# EAGLE design Versie 3 (EAGLE 7.3.0)

## Sheet 1 of 2
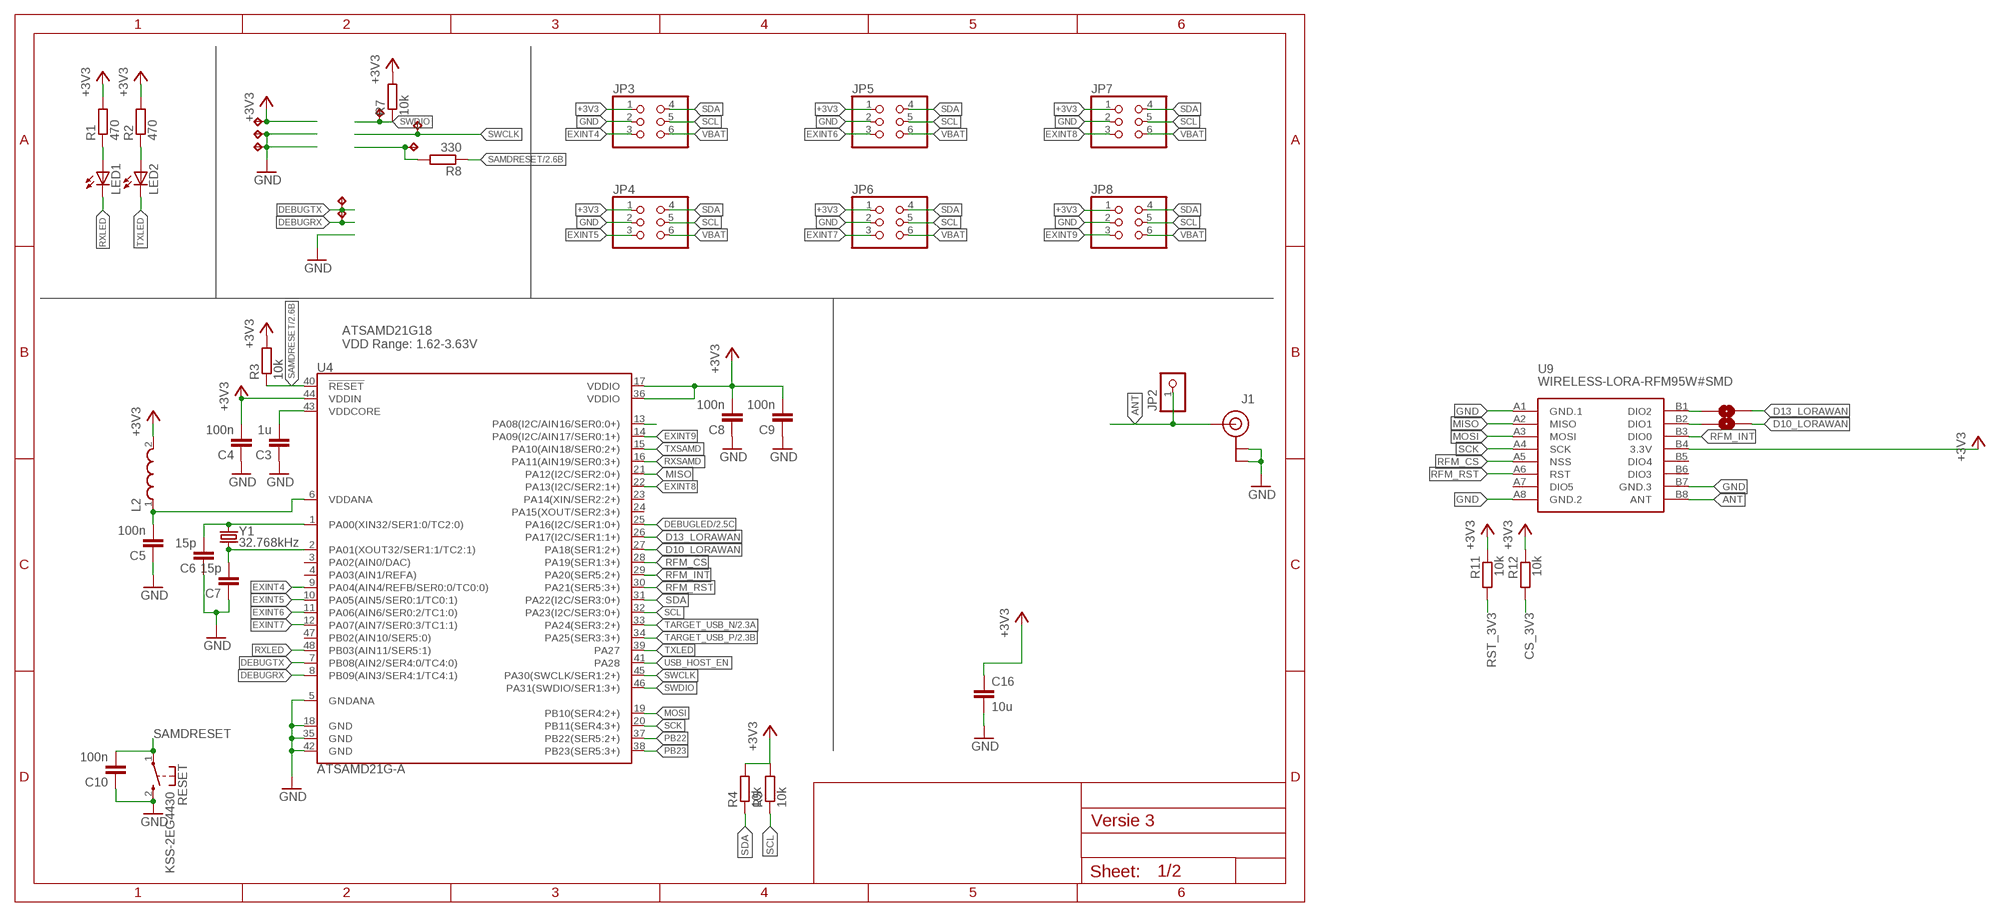
[diagram p0: schematic, sheet 1]

### Parts
C3  1u  C-EUC0603  [C0603]
C4  100n  C-EUC0603  [C0603]
C5  100n  C-EUC0603  [C0603]
C6  15p  C-EUC0603  [C0603]
C7  15p  C-EUC0603  [C0603]
C8  100n  C-EUC0603  [C0603]
C9  100n  C-EUC0603  [C0603]
C10  100n  C-EUC0603  [C0603]
C16  10u  C-EUC0603  [C0603]
J1  U.FL  [U.FL]
JP2  PINHD-1X1  [1X01]
JP3  PINHD-2X3  [2X03]
JP4  PINHD-2X3  [2X03]
JP5  PINHD-2X3  [2X03]
JP6  PINHD-2X3  [2X03]
JP7  PINHD-2X3  [2X03]
JP8  PINHD-2X3  [2X03]
JP9  JUMPER-SMT_2_NO_NO-SILK  [SMT-JUMPER_2_NO_NO-SILK]
JP10  JUMPER-SMT_2_NO_NO-SILK  [SMT-JUMPER_2_NO_NO-SILK]
L2  WE-CBA_0603(WB/HS)  [WE-CBA_0603(W=2.2)]
LED1  LEDCHIP-LED0603  [CHIP-LED0603]
LED2  LEDCHIP-LED0603  [CHIP-LED0603]
R1  470  R-EU_R0603  [R0603]
R2  470  R-EU_R0603  [R0603]
R3  10k  R-EU_R0603  [R0603]
R4  10k  R-EU_R0603  [R0603]
R5  10k  R-EU_R0603  [R0603]
R7  10k  R-EU_R0603  [R0603]
R8  330  R-EU_R0603  [R0603]
R11  10k  R-EU_0204/7  [0204/7]
R12  10k  R-EU_0204/7  [0204/7]
RESET  KSS-2EG4430  [KSS-2EG4430]
TP1  TPB1,27  [B1,27]
TP2  TPB1,27  [B1,27]
TP3  TPB1,27  [B1,27]
TP4  TPB1,27  [B1,27]
TP5  TPB1,27  [B1,27]
TP6  TPB1,27  [B1,27]
TP7  TPB1,27  [B1,27]
TP8  TPB1,27  [B1,27]
U4  ATSAMD21G-A  [TQFP-48]
U9  WIRELESS-LORA-RFM95W#SMD  [WIRELESS-LORA-RFM95W#SMD]
Y1  32.768kHz  CRYSTAL3.2X1.5MM  [CRYSTAL-SMD-3.2X1.5MM]

### Nets
+3V3: C4.2 C8.2 C9.2 C16.1 JP3.1 JP4.1 JP5.1 JP6.1 JP7.1 JP8.1 L2.2 R1.2 R2.2 R3.2 R4.2 R5.2 R7.2 R11.1 R12.1 TP1.TP U4.17(VDDIO) U4.36(VDDIO) U4.44(VDDIN) U9.B4(3.3V) ; also sheet 2
ANT: J1.P$3(SIGNAL) JP2.1 U9.B8(ANT)
BUTTON: U4.13(PA08(I2C/AIN16/SER0:0+)) ; also sheet 2
CS_3V3: R12.2
D10_LORAWAN: JP10.2 U4.27(PA18(SER1:2+))
D13_LORAWAN: JP9.2 U4.26(PA17(I2C/SER1:1+))
DEBUGLED: U4.25(PA16(I2C/SER1:0+)) ; also sheet 2
DEBUGRX: TP8.TP U4.8(PB09(AIN3/SER4:1/TC4:1))
DEBUGTX: TP7.TP U4.7(PB08(AIN2/SER4:0/TC4:0))
EXINT4: JP3.3 U4.9(PA04(AIN4/REFB/SER0:0/TC0:0))
EXINT5: JP4.3 U4.10(PA05(AIN5/SER0:1/TC0:1))
EXINT6: JP5.3 U4.11(PA06(AIN6/SER0:2/TC1:0))
EXINT7: JP6.3 U4.12(PA07(AIN7/SER0:3/TC1:1))
EXINT8: JP7.3 U4.22(PA13(I2C/SER2:1+))
EXINT9: JP8.3 U4.14(PA09(I2C/AIN17/SER0:1+))
GND: C3.1 C4.1 C5.1 C6.1 C7.1 C8.1 C9.1 C10.1 C16.2 J1.P$1(GND) J1.P$2(GND) JP3.2 JP4.2 JP5.2 JP6.2 JP7.2 JP8.2 RESET.2(S) TP2.TP TP3.TP U4.5(GNDANA) U4.18(GND) U4.35(GND) U4.42(GND) U9.A1(GND.1) U9.A8(GND.2) U9.B7(GND.3) ; also sheet 2
MISO: U4.21(PA12(I2C/SER2:0+)) U9.A2(MISO)
MOSI: U4.19(PB10(SER4:2+)) U9.A3(MOSI)
N$1: LED1.A R1.1
N$2: LED2.A R2.1
N$4: JP10.1 U9.B2(DIO1)
N$5: C6.2 U4.1(PA00(XIN32/SER1:0/TC2:0)) Y1.P$2
N$6: C7.2 U4.2(PA01(XOUT32/SER1:1/TC2:1)) Y1.P$1
N$7: C5.2 L2.1 U4.6(VDDANA)
N$13: JP9.1 U9.B1(DIO2)
N$15: R8.2 TP6.TP
PB22: U4.37(PB22(SER5:2+))
PB23: U4.38(PB23(SER5:3+))
RFM_CS: U4.28(PA19(SER1:3+)) U9.A5(NSS)
RFM_INT: U4.29(PA20(SER5:2+)) U9.B3(DIO0)
RFM_RST: U4.30(PA21(SER5:3+)) U9.A6(RST)
RST_3V3: R11.2
RXLED: LED1.C U4.48(PB03(AIN11/SER5:1))
RXSAMD: U4.16(PA11(AIN19/SER0:3+))
SAMDRESET: C10.2 R3.1 R8.1 RESET.1(P) U4.40(!RESET!) ; also sheet 2
SCK: U4.20(PB11(SER4:3+)) U9.A4(SCK)
SCL: JP3.5 JP4.5 JP5.5 JP6.5 JP7.5 JP8.5 R5.1 U4.32(PA23(I2C/SER3:0+))
SDA: JP3.4 JP4.4 JP5.4 JP6.4 JP7.4 JP8.4 R4.1 U4.31(PA22(I2C/SER3:0+))
SWCLK: TP5.TP U4.45(PA30(SWCLK/SER1:2+))
SWDIO: R7.1 TP4.TP U4.46(PA31(SWDIO/SER1:3+))
TARGET_USB_N: U4.33(PA24(SER3:2+)) ; also sheet 2
TARGET_USB_P: U4.34(PA25(SER3:3+)) ; also sheet 2
TXLED: LED2.C U4.39(PA27)
TXSAMD: U4.15(PA10(AIN18/SER0:2+))
USB_HOST_EN: U4.41(PA28)
VBAT: JP3.6 JP4.6 JP5.6 JP6.6 JP7.6 JP8.6 ; also sheet 2
VDDCORE: C3.2 U4.43(VDDCORE)
Unconnected: U4.3(PA02(AIN0/DAC)) U4.4(PA03(AIN1/REFA)) U4.23(PA14(XIN/SER2:2+)) U4.24(PA15(XOUT/SER2:3+)) U4.47(PB02(AIN10/SER5:0)) U9.A7(DIO5) U9.B5(DIO4) U9.B6(DIO3)

### Notes on the sheet
- ATSAMD21G18
  VDD Range: 1.62-3.63V

## Sheet 2 of 2
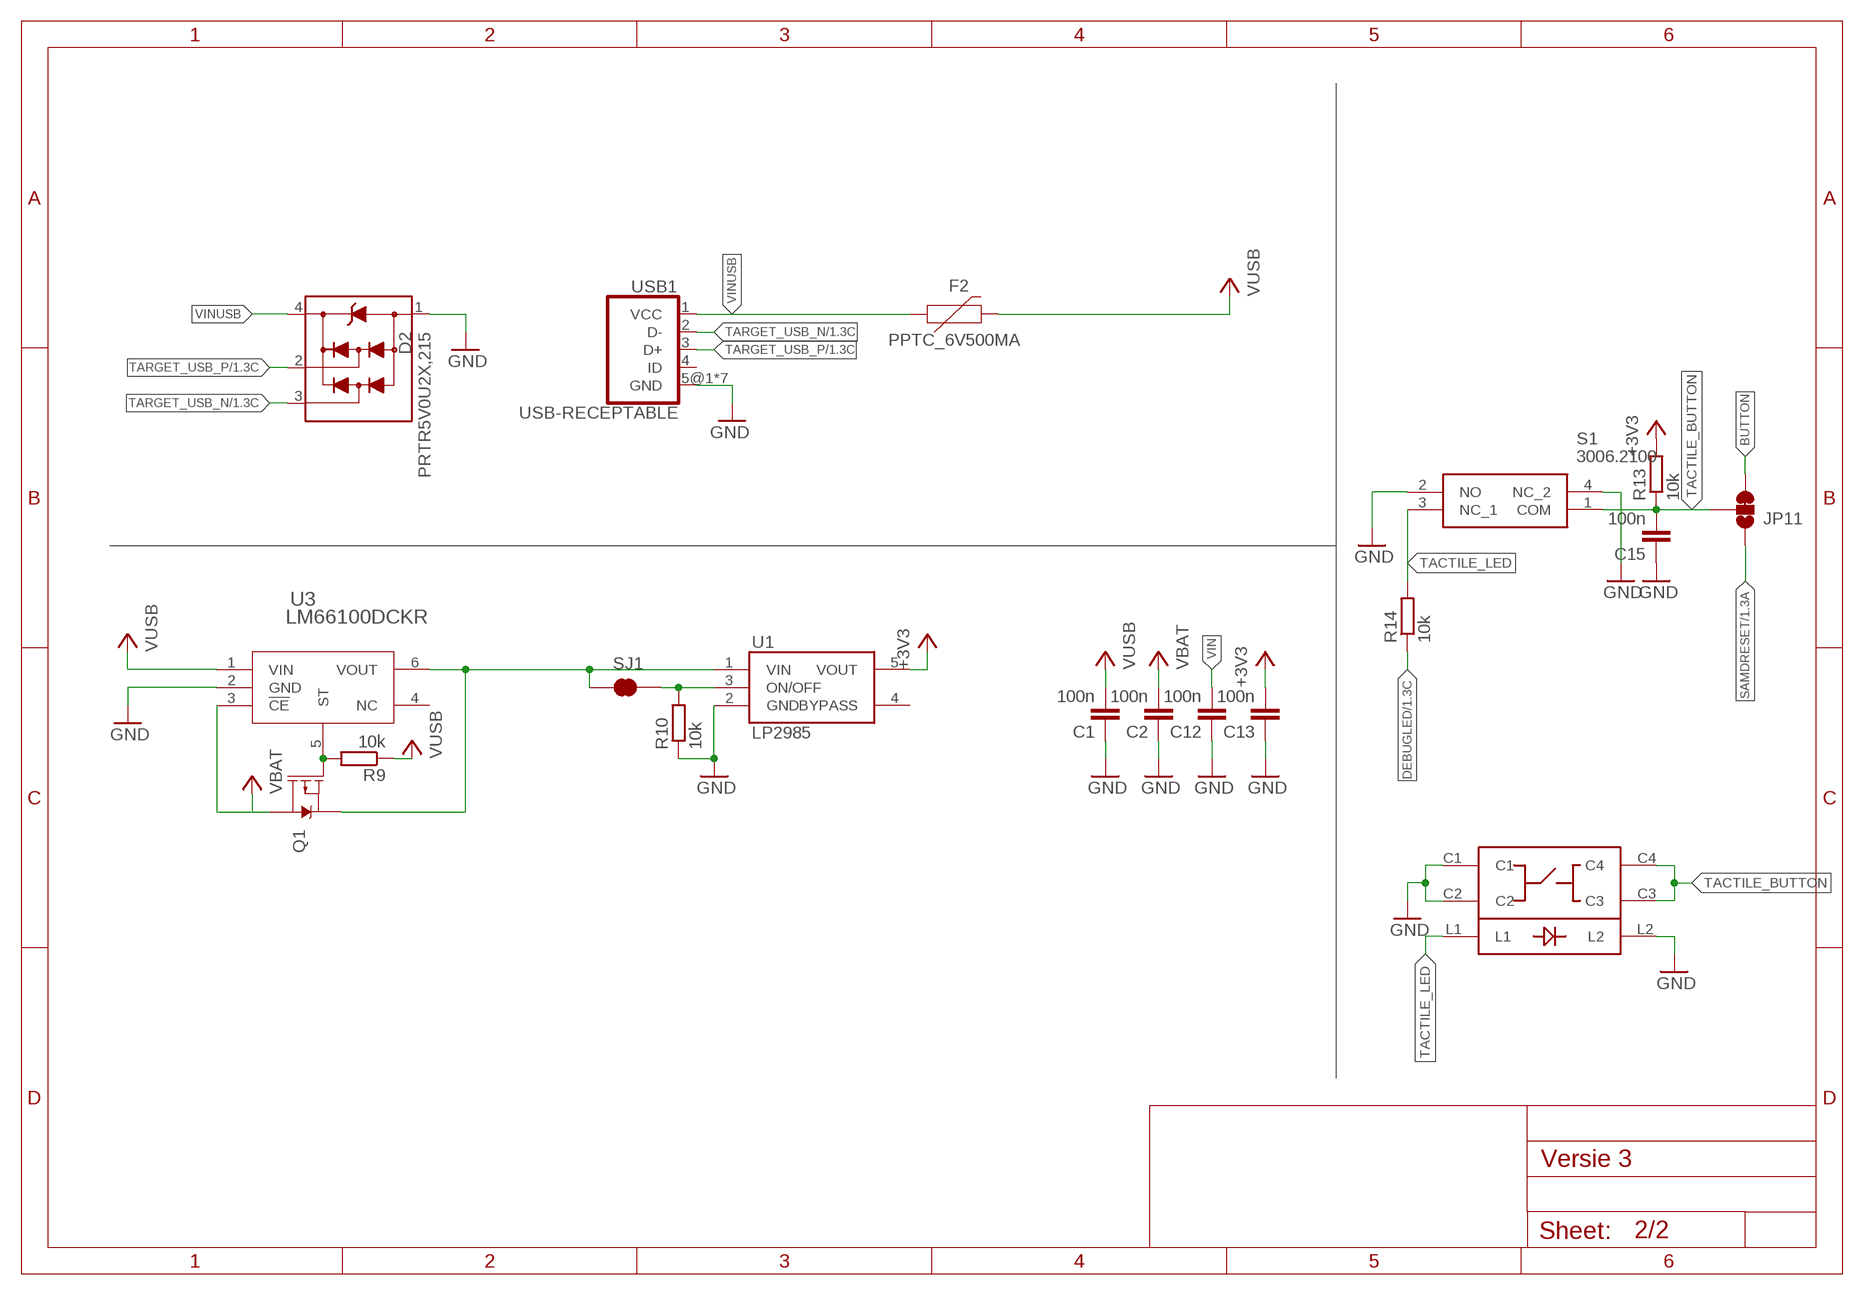
[diagram p1: schematic, sheet 2]

### Parts
C1  100n  C-EUC0603  [C0603]
C2  100n  C-EUC0603  [C0603]
C12  100n  C-EUC0603  [C0603]
C13  100n  C-EUC0603  [C0603]
C15  100n  C-EUC0603  [C0603]
D2  PRTR5V0U2X,215  [SOT143B]
F2  PPTC_6V500MA  [0805]
JP11  JUMPER-SMT_3_1-NC_TRACE_SILK  [SMT-JUMPER_3_1-NC_TRACE_SILK]
Q1  MOSFET_PCH-DMG2307L  [SOT23-3]
R9  10k  R-EU_R0603  [R0603]
R10  10k  R-EU_R0603  [R0603]
R13  10k  R-EU_R0603  [R0603]
R14  10k  R-EU_R0603  [R0603]
S1  3006.2100  [30062101]
SJ1  JUMPER-PAD-2-NC_BY_TRACENO_SILK  [PAD-JUMPER-2-NC_BY_TRACE_NO_SILK]
U1  LP2985AIM5-3.3  [SOT25]
U3  LM66100DCKR  [DCK6_TEX]
U$1  LS1201  [LS1201]
USB1  USB-RECEPTABLE  [FCI-10103594-0001LF]

### Nets
+3V3: C13.2 R13.2 U1.5(VOUT) ; also sheet 1
BUTTON: JP11.3 ; also sheet 1
DEBUGLED: R14.1 ; also sheet 1
GND: C1.1 C2.1 C12.1 C13.1 C15.1 D2.1 R10.1 S1.2(NO) S1.4(NC_2) U1.2(GND) U3.2(GND) U$1.C1 U$1.C2 U$1.L2 USB1.5@1(GND) USB1.5@2(GND) USB1.5@3(GND) USB1.5@4(GND) USB1.5@5(GND) USB1.5@6(GND) USB1.5@7(GND) ; also sheet 1
N$14: Q1.1(G) R9.2 U3.5(ST)
ONOFF: R10.2 SJ1.1 U1.3(ON/OFF)
SAMDRESET: JP11.1 ; also sheet 1
TACTILE_BUTTON: C15.2 JP11.2 R13.1 S1.1(COM) U$1.C3 U$1.C4
TACTILE_LED: R14.2 S1.3(NC_1) U$1.L1
TARGET_USB_N: D2.3 USB1.2(D-) ; also sheet 1
TARGET_USB_P: D2.2 USB1.3(D+) ; also sheet 1
VBAT: C2.2 Q1.3(D) U3.3(!CE) ; also sheet 1
VIN: C12.2 Q1.2(S) SJ1.2 U1.1(VIN) U3.6(VOUT)
VINUSB: D2.4 F2.1 USB1.1(VCC)
VUSB: C1.2 F2.2 R9.1 U3.1(VIN)
Unconnected: U1.4(BYPASS) U3.4(NC) USB1.4(ID)

## Library data of the parts
C1-C10 C12 C13 C15 C16 = rcl:C-EU: CAPACITOR, European symbol
D2 = PRTR5V0U2X_215:PRTR5V0U2X,215: Ultra low capacitance double rail-to-rail ESD protection diode Check prices <https://pricing.snapeda.com/parts/PRTR5V0U2X%2C215/Nexperia%20USA%20Inc./view-part?ref=eda>; AVAILABILITY: Good; DESCRIPTION: Clamp Ipp Tvs Diode Surface Mount SOT-143B; MF: Nexperia USA Inc.; MP: PRTR5V0U2X,215; PACKAGE: None; PRICE: None; PURCHASE-URL: https://pricing.snapeda.com/search/part/PRTR5V0U2X,215/?ref=eda
F2 = SparkFun-Fuses:PPTC: Resettable Fuse PPTC Resettable Fuse. Really a sort of resistor with a polymeric positive temperature coefficient whose resistance increases dramatically with an increase in temperature. When heated by the power passing through the resistance rises causing the current to be limited, protecting the circuit. This is achieved by the transition of the polymer from a crystalline to an amorphous state where the conductive carbon separates breaking the conductive pathways found in the cool crystalline structure. When a PPTC cools back down it resumes conducting letting the circuit turn back on. SparkFun Products: SparkFun RedBoard - Programmed with Arduino <https://www.sparkfun.com/products/12757> Pro Micro - 5V/16MHz <https://www.sparkfun.com/products/12640> Arduino Pro 328 - 5V/16MHz <https://www.sparkfun.com/products/10915> MP3 Trigger <https://www.sparkfun.com/products/13720>
J1 = SparkFun-Connectors:U.FL: SMD antenna connector- WRL-09144; PROD_ID: CONN-09193
JP2 = pinhead:PINHD-1X1: PIN HEADER
JP3-JP8 = pinhead_edge:PINHD-2X3: PIN HEADER
JP9 JP10 = SparkFun-Jumpers:JUMPER-SMT_2_NO: Normally open jumper This jumper has two pads in close proximity to each other. Apply solder to close the connection. Round pads are easier to solder for beginners, but are a lot larger. SparkFun Product that uses the round pads: SparkFun EL Sequencer <https://www.sparkfun.com/products/12781>
JP11 = SparkFun-Jumpers:JUMPER-SMT_3_1-NC_TRACE: Normally closed trace jumper (1 of 2 connections) This jumper has a trace between two pads so it's normally closed (NC). The other connection is normally open (NO). Use a razor knife to open the connection. For best results follow the IPC guidelines for cutting traces: Cutout at least 0.063 mm (0.005 in). Remove all loose material to clean up the cut area. Seal the cut with an approved epoxy. Reapply solder to reclose the connection, or to close the NO connection.
L2 = EagleLibrary_Wuerth_Elektronik_eiSos_rev16a:WE-CBA: WE-CBA SMD EMI Suppression Ferrite Bead Characteristics Reliable Ni-Sn electrodes High rated current up to 5A Recommended soldering: Reflow Operating temperature: -55°C to +125°C Applications * Perfect as data line filter and for uncoupling of distribution voltage *This special SMD chip bead ferrites can be put directly on the printed circuit board. They offer excellent anti-EMI properties and low DC-resistance. Placed very close next to the interference source even with smallest size 0402,maximal impedance at 1000 Ω can be reached. *High Speed: "High Speed " SMD ferrites WE-CBF have lower impedance in the lower frequency ranges thus they have only a low attenuation for fast signals. Application e.g. USB 2.0, IEEE 1394,LVDS *Wide Band: "Wide Band" SMD ferrites WE-CBF already show high impedance in low frequency range. Therefore they are wide band through the whole spectrum. Application e.g. control signats, RS232, RS422, DC/DC converter *High Current: "High Current " SMD ferrites WE-CBF are designed for high current (over 1 A). The rated current refers to 40K self-heating. High current SMD ferrites are available in all there types (High Speed, Wide Band and High Frequency). Application e.g. power supply, DC/DC converter *Advice: Pay attention for the use of SMD-Ferrites for high current>1A and ambient temperature over +85°C that the rated current has to be reduced when temperature is above +85°C (Derating). *At+100°C environment temperature the maximal rated current has to add up to only 60% of the data sheet value ,without an overload of the component. Variant abbreviation WB means WIDE BAND HS means HIGH SPEED HC means HIGH CURRENT <http://katalog.we-online.de/media/images/eisos/FeCBA_pf2.jpg> Details see: http://katalog.we-online.de/en/pbs/WE-CBA/ Created: 2015-02-02 2015 (C) Wurth Elektronik
LED1 LED2 = led:LED: LED OSRAM: - CHIPLED LG R971, LG N971, LY N971, LG Q971, LY Q971, LO R971, LY R971 LH N974, LH R974 LS Q976, LO Q976, LY Q976 LO Q996 - Hyper CHIPLED LW Q18S LB Q993, LB Q99A, LB R99A - SideLED LS A670, LO A670, LY A670, LG A670, LP A670 LB A673, LV A673, LT A673, LW A673 LH A674 LY A675 LS A676, LA A676, LO A676, LY A676, LW A676 LS A679, LY A679, LG A679 - Hyper Micro SIDELED® LS Y876, LA Y876, LO Y876, LY Y876 LT Y87S - SmartLED LW L88C, LW L88S LB L89C, LB L89S, LG L890 LS L89K, LO L89K, LY L89K LS L896, LA L896, LO L896, LY L896 - TOPLED LS T670, LO T670, LY T670, LG T670, LP T670 LSG T670, LSP T670, LSY T670, LOP T670, LYG T670 LG T671, LOG T671, LSG T671 LB T673, LV T673, LT T673, LW T673 LH T674 LS T676, LA T676, LO T676, LY T676, LB T676, LH T676, LSB T676, LW T676 LB T67C, LV T67C, LT T67C, LS T67K, LO T67K, LY T67K, LW E67C LS E67B, LA E67B, LO E67B, LY E67B, LB E67C, LV E67C, LT E67C LW T67C LS T679, LY T679, LG T679 LS T770, LO T770, LY T770, LG T770, LP T770 LB T773, LV T773, LT T773, LW T773 LH T774 LS E675, LA E675, LY E675, LS T675 LS T776, LA T776, LO T776, LY T776, LB T776 LHGB T686 LT T68C, LB T68C - Hyper Mini TOPLED® LB M676 - Mini TOPLED Santana® LG M470 LS M47K, LO M47K, LY M47K Source: http://www.osram.convergy.de LUXEON: - LUMILED® LXK2-PW12-R00, LXK2-PW12-S00, LXK2-PW14-U00, LXK2-PW14-V00 LXK2-PM12-R00, LXK2-PM12-S00, LXK2-PM14-U00 LXK2-PE12-Q00, LXK2-PE12-R00, LXK2-PE12-S00, LXK2-PE14-T00, LXK2-PE14-U00 LXK2-PB12-K00, LXK2-PB12-L00, LXK2-PB12-M00, LXK2-PB14-N00, LXK2-PB14-P00, LXK2-PB14-Q00 LXK2-PR12-L00, LXK2-PR12-M00, LXK2-PR14-Q00, LXK2-PR14-R00 LXK2-PD12-Q00, LXK2-PD12-R00, LXK2-PD12-S00 LXK2-PH12-R00, LXK2-PH12-S00 LXK2-PL12-P00, LXK2-PL12-Q00, LXK2-PL12-R00 Source: www.luxeon.com KINGBRIGHT: KA-3528ASYC Source: www.kingbright.com
Q1 = SparkFun-DiscreteSemi:MOSFET_PCH: P-channel MOSFETs Voltage controlled devices that allow control of high current outputs. SparkFun Products: SparkFun ESP32 Thing <https://www.sparkfun.com/products/13907> SparkFun ESP8266 Thing <https://www.sparkfun.com/products/13231>; PROD_ID: TRANS-11308; VALUE: 2.5A/30V/105mΩ
R1-R5 R7-R10 R13 R14 = rcl:R-EU_: RESISTOR, European symbol
R11 R12 = resistor:R-EU_: RESISTOR, European symbol
RESET = buttons:KSS-2EG4430: Size: 3x6mm Height: 5mm from PCB Rating: DC12v 50mA Travel: 0.25±0.10mm Operating Force: 180±50gf Return Force: 60gf min Contact resistance: 100m? max Insulation resistance: 100M? min Operating life?50,000 cycles
S1 = SamacSys_Parts:3006.2100: Tactile Switches TACTILE Source: Datasheet <http://www.mouser.cn/datasheet/2/467/Marquardt_007102018_Specifcation3006_Series-1379934.pdf>; DESCRIPTION: Tactile Switches TACTILE; HEIGHT: 4.15mm; MANUFACTURER_NAME: MARQUARDT; MANUFACTURER_PART_NUMBER: 3006.2100; MOUSER_PART_NUMBER: 979-3006.2100
SJ1 = SparkFun-Passives:JUMPER-PAD-2-NC_BY_TRACE
TP1-TP8 = testpad:TP: Test pad
U1 = LP2985:LP2985: LP2985-N Micropower 150 mA Low-Noise Ultra Low-Dropout Regulator
U3 = LM66100:LM66100DCKR; BUILT_BY: EMA_Jessica; COPYRIGHT: Copyright (C) 2018 Accelerated Designs. All rights reserved; MANUFACTURER_PART_NUMBER: LM66100DCKR; SOURCELIBRARY: TI_2019-12-20; VENDOR: Texas Instruments
U4 = samd21-temp:ATSAMD21G: Atmel SAMD21G SMART ARM-Based Microcontroller The Atmel ® | SMART ™ SAM D21 is a series of low-power microcontrollers using the 32-bit ARM ® Cortex ® -M0+ processor, and ranging from 32- to 64-pins with up to 256KB Flash and 32KB of SRAM. The SAM D21 devices operate at a maximum frequency of 48MHz and reach 2.46 CoreMark/MHz. They are designed for simple and intuitive migration with identical peripheral modules, hex compatible code, identical linear address map and pin compatible migration paths between all devices in the product series. All devices include intelligent and flexible peripherals, Atmel Event System for inter-peripheral signaling, and support for capacitive touch button, slider and wheel user interfaces.; PROD_ID: IC-13064
U9 = diy-modules:WIRELESS-LORA-RFM95W: 868/915 MHz LoRa Radio Transceiver Module based on SX1276 chip Click here to find device on ebay.com <http://www.ebay.com/sch/RFM95W+transceiver>
U$1 = button:LS1201
USB1 = daspilker:USB-RECEPTABLE: USB Receptable
Y1 = samd21-temp:CRYSTAL: Various standard crystals. Proven footprints.; PROD_ID: XTAL-13062

## Net classes
0 default: clearance 0.205 mm

## Board
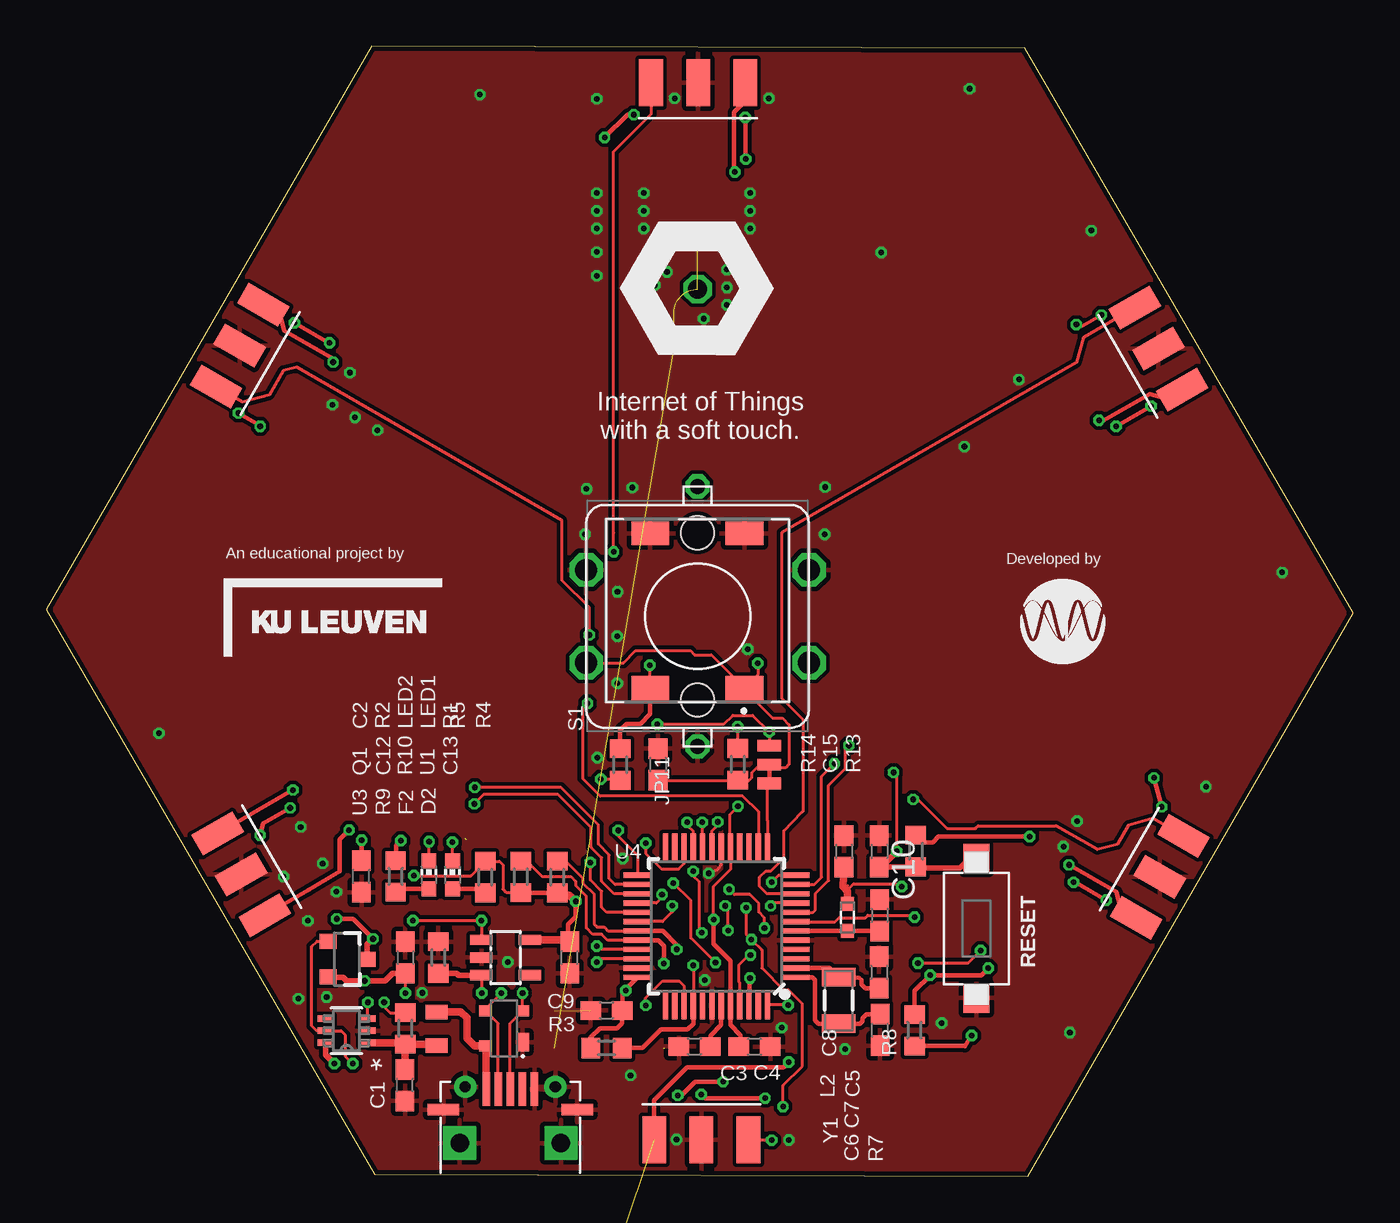
[diagram p2: board, top side]
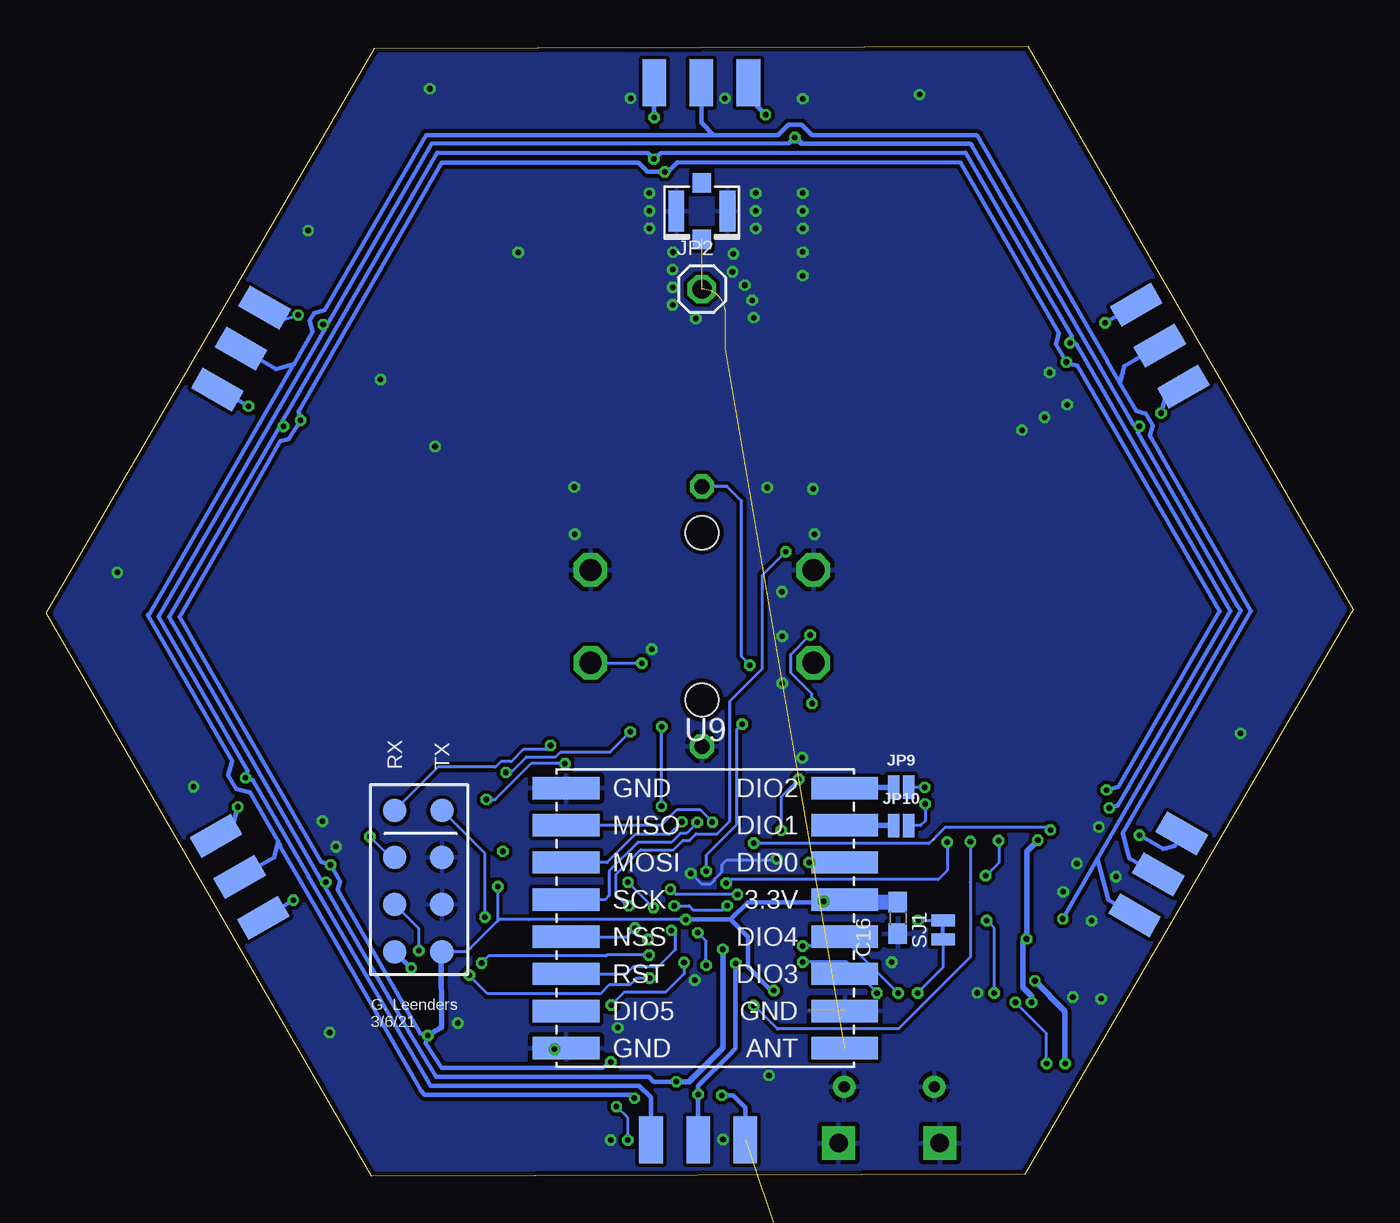
[diagram p3: board, bottom side, seen from below]

Size 70.33 x 60.81 mm. Coordinates in mm from the lower left corner, seen from the top.
Outline: 0,30.5 17.66,0.09 52.83,0 70.33,30.31 52.66,60.72 17.5,60.81 0,30.5
Copper layers (1*16): Top 0.035mm / dielectric 1.5mm / Bottom 0.035mm
Design rules "SeeedStudio_2layer_DRU_no_angle_20140221 *": minimum track width 6mil, minimum drill 0.3mm, track to track 6mil, track to pad 6mil, pad to pad 6mil, via to via 6mil, smd to smd 0mil, copper to edge 10mil, drill to drill 10mil, minimum pad ring 10mil, minimum via ring 6mil, stop-mask expansion 2mil, vias tented up to drill 100mil, thermal gap 10mil

### Footprints (pad centres in the part's own frame; a part is rotated, then mirrored left to right if it is on the bottom)
C0603 = smd 1.1 x 1: 1 -0.85,0; 2 0.85,0
SOT143B = smd 1 x 0.7: 1 -0.75,-1 | smd 0.6 x 0.7: 2 0.95,-1; 3 0.95,1; 4 -0.95,1
0805 = smd 0.8 x 1.2: 1 -0.9,0; 2 0.9,0
U.FL = smd 2.2 x 0.85: P$1 0,1.375; P$2 0,-1.375 | smd 1.05 x 1: P$3 1.525,0; P$4 -1.525,0
1X01 = drill 1.016 octagon: 1 0,0
2X03 = smd 1.27 x 2.54: 1 -2.54,1.905; 2 0,1.905; 3 2.54,1.905 | smd 1.27 x 2.54 bottom: 4 -2.54,1.905; 5 0,1.905; 6 2.54,1.905
SMT-JUMPER_2_NO_NO-SILK = smd 0.635 x 1.27: 1 -0.406,0; 2 0.406,0
SMT-JUMPER_3_1-NC_TRACE_SILK = smd 0.635 x 1.27: 1 -1.016,0; 2 0,0; 3 1.016,0
WE-CBA_0603(W=2.2) = smd 0.75 x 0.7: 1 -0.725,0; 2 0.725,0
CHIP-LED0603 = smd 0.8 x 0.8: A 0,-0.75; C 0,0.75
SOT23-3 = smd 0.8 x 0.9: 1 -0.95,-1; 2 0.95,-1; 3 0,1.1
R0603 = smd 1 x 1.1: 1 -0.85,0; 2 0.85,0
0204/7 = drill 0.813 octagon: 1 -3.81,0; 2 3.81,0
KSS-2EG4430 = smd 1.6 x 1.4: 1 -3.75,0; 2 3.75,0
30062101 = smd 2.025 x 1.275: 1 2.537,-4.162; 2 -2.538,4.162; 3 -2.538,-4.162; 4 2.537,4.162
PAD-JUMPER-2-NC_BY_TRACE_NO_SILK = smd 0.635 x 1.27: 1 -0.508,0; 2 0.508,0
B1,27 = smd 1.27 x 1.27: TP 0,0
SOT25 = smd 0.55 x 1.2: 1 -0.95,-1.3; 2 0,-1.3; 3 0.95,-1.3; 4 0.95,1.3; 5 -0.95,1.3
DCK6_TEX = smd 0.851 x 0.356: 1 -1.137,0.65; 2 -1.137,0; 3 -1.137,-0.65; 4 1.137,-0.65; 5 1.137,0; 6 1.137,0.65
TQFP-48 = smd 1.5 x 0.28: 1 -4.25,2.75; 2 -4.25,2.25; 3 -4.25,1.75; 4 -4.25,1.25; 5 -4.25,0.75; 6 -4.25,0.25; 7 -4.25,-0.25; 8 -4.25,-0.75; 9 -4.25,-1.25; 10 -4.25,-1.75; 11 -4.25,-2.25; 12 -4.25,-2.75; 25 4.25,-2.75; 26 4.25,-2.25; 27 4.25,-1.75; 28 4.25,-1.25; 29 4.25,-0.75; 30 4.25,-0.25; 31 4.25,0.25; 32 4.25,0.75; 33 4.25,1.25; 34 4.25,1.75; 35 4.25,2.25; 36 4.25,2.75 | smd 0.28 x 1.5: 13 -2.75,-4.25; 14 -2.25,-4.25; 15 -1.75,-4.25; 16 -1.25,-4.25; 17 -0.75,-4.25; 18 -0.25,-4.25; 19 0.25,-4.25; 20 0.75,-4.25; 21 1.25,-4.25; 22 1.75,-4.25; 23 2.25,-4.25; 24 2.75,-4.25; 37 2.75,4.25; 38 2.25,4.25; 39 1.75,4.25; 40 1.25,4.25; 41 0.75,4.25; 42 0.25,4.25; 43 -0.25,4.25; 44 -0.75,4.25; 45 -1.25,4.25; 46 -1.75,4.25; 47 -2.25,4.25; 48 -2.75,4.25
WIRELESS-LORA-RFM95W#SMD = smd 3.6 x 1.2: A1 -7.5,7; A2 -7.5,5; A3 -7.5,3; A4 -7.5,1; A5 -7.5,-1; A6 -7.5,-3; A7 -7.5,-5; A8 -7.5,-7; B1 7.5,7; B2 7.5,5; B3 7.5,3; B4 7.5,1; B5 7.5,-1; B6 7.5,-3; B7 7.5,-5; B8 7.5,-7
LS1201 = drill 1.2 octagon: C1 0,5; C2 12,5; C3 0,0; C4 12,0 | drill 0.8 octagon: L1 6,9.5; L2 6,-4.5 | hole 1.8: 6,-2; 6,7
FCI-10103594-0001LF = smd 0.4 x 1.8: 1 -1.3,4.6; 2 -0.65,4.6; 3 0,4.6; 4 0.65,4.6; 5@1 1.3,4.6 | drill 0.6 pad 1.2: 5@2 -2.425,4.73; 5@3 2.425,4.73 | drill 1 pad 1.778 square: 5@4 -2.725,1.7; 5@5 2.725,1.7 | smd 1.7 x 0.635: 5@6 -3.6,3.5; 5@7 3.6,3.5
CRYSTAL-SMD-3.2X1.5MM = smd 1 x 1.8: P$1 -1.25,0; P$2 1.25,0

### Placement (x,y rotation side)
C1  19.3,4.9 90 top
C2  16.95,16.14 90 top
C3  34.88,6.99 0 top
C4  38.11,6.97 180 top
C5  44.84,14.04 270 top
C6  44.87,7.87 90 top
C7  44.82,10.97 270 top
C8  42.92,17.48 270 top
C9  30.15,8.92 0 top
C10  44.83,17.49 270 top
C12  19.31,11.77 270 top
C13  28.17,11.77 90 top
C15  32.92,22.16 270 top
C16  24.5,13.9 270 bottom
D2  24.64,7.96 90 top
F2  21,7.93 270 top
J1  35.05,51.95 270 bottom
JP2  35.05,47.75 0 bottom
JP3  35.08,60.76 180 top
JP4  61.51,45.5 120 top
JP5  61.58,15.16 60 top
JP6  35.25,0.05 0 top
JP7  8.83,15.3 300 top
JP8  8.75,45.66 240 top
JP9  24.32,20.94 0 bottom
JP10  24.32,18.87 0 bottom
JP11  38.91,22.15 270 top
L2  43.13,13.93 90 top
LED1  21.85,16.21 0 top
LED2  20.58,16.21 0 top
Q1  16.16,11.68 270 top
R1  23.62,16.1 90 top
R2  18.79,16.14 90 top
R3  30.15,6.9 180 top
R4  27.49,16.1 270 top
R5  25.53,16.11 270 top
R7  46.72,7.86 270 top
R8  46.8,17.5 90 top
R9  19.31,7.96 90 top
R10  21.09,11.77 270 top
R11  16.07,-59.07 0 top  (outside the outline)
R12  6.54,-72.72 0 top  (outside the outline)
R13  37.21,22.18 90 top
R14  30.88,22.15 90 top
RESET  50.05,13.34 270 top
S1  35.04,30.44 0 top
SJ1  22.06,13.25 90 bottom
TP1  49.05,12.09 0 bottom
TP2  49.05,14.63 0 bottom
TP3  49.05,17.17 0 bottom
TP4  51.59,12.09 0 bottom
TP5  51.59,14.63 0 bottom
TP6  51.59,17.17 0 bottom
TP7  49.04,19.69 0 bottom
TP8  51.58,19.69 0 bottom
U1  24.71,11.77 270 top
U3  16.15,7.83 180 top
U4  36.07,13.45 180 top
U9  34.86,13.89 0 bottom
U$1  29.04,27.63 0 top
USB1  24.97,0.08 0 top
Y1  42.64,9.46 270 top

### Tracks (layer width: path | path; a pad name or v marks a point on that pad's centre or on a via)
+3V3  (via drill 0.3)  (2 unrouted)
  Top 0.152: 36.83,17.69 36.83,16.52 35.91,15.6 v35.91,13.81 | R13.2 v37.21,24.19 v37.2,24.2 | U4.17 36.8,17.72 36.8,19.48 v37.22,19.91 | 43.13,15.65 L2.2 43.12,14.64 43.12,15.41 43.45,15.74 45.89,15.74 v46.04,15.59 | 23.98,16.95 24.38,16.95 24.57,16.76 24.57,15.46 24.75,15.29 25.51,15.29 R5.2 | v19.77,16.18 22.85,16.18 R1.2
  Top 0.254: 37.28,6.84 C4.2 37.36,6.92 37.36,7.59 36.82,8.14 U4.44 36.83,9.21 36.83,11.59 35.91,12.51 v35.91,13.81 | 31,9.88 C9.2 30.99,8.91 30.99,8.23 30.72,7.96 29.79,7.96 29.3,7.46 R3.2 | 31,9.88 U4.36 | 31,9.88 31.08,9.88 v31.19,9.99 | 36.83,17.69 U4.17 | R1.2 23.98,16.95 | R5.2 26.32,15.26 26.34,15.25 R4.2 28.03,15.25 v28.48,14.79 v28.49,14.79 28.49,13.97 28.07,13.55 28.07,12.72 | R2.2 18.82,17.8 v19.07,18.06 | R7.2 49.41,7.01 49.45,7 v49.79,7.57 49.79,7.58 | JP6.1 32.71,4.1 34.47,5.85 39.66,5.85 v39.95,6.14 | v13.26,20.79 JP7.1 | JP8.1 12.57,46.38 12.8,45.51 15.37,44.03 v15.43,43.82 | JP3.1 37.62,57.88 37,57.26 37,54.11 v37.06,54.06 | JP4.1 60.29,41.86 59.38,42.11 56.83,40.63 v56.65,40.68 | JP5.1 57.84,14.38 57.59,15.3 55.06,16.76 v55.03,16.76
  Top 0.406: U1.5 28.07,12.72 C13.2 | 28.15,15.12 v28.48,14.79 | L2.2 43.13,15.34 42.87,15.59 C8.2
  Bottom 0.152: TP1.TP 47.69,12.08 47.49,12.28 46.04,13.74 | v35.91,13.81 44.36,13.81 45.99,13.81 | 45.99,13.81 | 45.99,13.81 45.99,13.79 46.04,13.74 | v46.04,15.59 46.04,13.74 | v19.07,18.06 19.07,16.85 v19.77,16.18 | v37.22,19.91 37.22,24.17 v37.21,24.19
  Bottom 0.254: v15.43,43.82 15.43,43.78 14.84,43.62 7.18,30.4 7.19,30.4 12.31,21.53 12.64,20.96 v13.26,20.79 | v39.95,6.14 40.4,5.85 49.07,5.82 49.91,7.15 v49.79,7.57 50.21,7.68 50.36,7.94 54.66,15.42 54.53,15.88 v55.03,16.76 55.08,16.79 55.55,16.91 62.15,28.35 63.16,30.1 63.16,30.11 60.43,34.83 57.76,39.57 57.29,39.69 v56.65,40.68 56.64,40.7 56.76,41.16 49.17,54.37 49.05,54.56 38.47,54.56 37.97,54.06 v37.06,54.06 36.88,54.06 36.37,54.57 21.13,54.56 21.11,54.53 15.82,45.38 15.98,44.78 v15.43,43.82 | 49.08,12.08 TP1.TP 49.06,12.07 | v15.43,43.82 | v35.91,13.81 33.51,13.81 | 33.51,13.81 32.58,14.75 28.53,14.75 v28.48,14.79 28.39,14.89 U9.B4 | v31.19,9.99 31.31,9.99 32.58,11.25 32.58,12.88 33.51,13.81
  Bottom 0.305: 49.08,12.08 49.07,8 v49.79,7.57
  Bottom 0.406: 49.05,12.11 TP1.TP
  Bottom 0.813: C16.1 28.44,14.75 v28.48,14.79
ANT  (7 unrouted)
BUTTON
  Top 0.152: U4.13 38.8,19.14 38.8,20.87 JP11.3
D10_LORAWAN  (via drill 0.3)
  Top 0.152: U4.27 30.55,15.2 29.88,15.87 29.88,17.14 29.32,17.7 29.32,18.77 27.55,20.54 23.53,20.54 v23.03,20.04
  Bottom 0.152: v23.03,20.04 23.03,19.12 23.28,18.87 JP10.2
D13_LORAWAN  (via drill 0.3)
  Top 0.152: U4.26 30.61,15.7 30.29,16.02 30.29,17.29 29.71,17.88 29.71,18.92 27.7,20.93 v23.05,20.93
  Bottom 0.152: v23.05,20.93 JP9.2
DEBUGLED  (via drill 0.3)
  Top 0.152: 30.78,21.17 R14.1 30.81,21.38 v29.84,21.38 | v30.78,18.61 30.78,18.3 31.82,17.26 U4.25
  Bottom 0.152: v30.78,18.61 30.78,20.44 v29.84,21.38
DEBUGRX  (via drill 0.3)
  Top 0.152: U4.8 41.27,14.2 41.39,14.32 41.39,15.21 42.1,15.92 42.1,21.03 43.01,21.94 43.01,23.01 v43.19,23.19
  Bottom 0.152: v43.19,23.19 43.42,22.96 44.67,22.96 45.3,22.32 45.86,22.32 46.16,22.02 49.25,22.02 TP8.TP
DEBUGTX  (via drill 0.3)
  Top 0.152: U4.7 42.45,13.7 42.66,13.91 44.08,13.91 44.21,14.04 46.62,14.04 v46.72,13.94
  Top 0.254: U4.7
  Bottom 0.152: 48.96,19.6 TP7.TP 46.72,17.37 v46.72,13.94
  Bottom 0.254: TP7.TP
EXINT4  (via drill 0.3)
  Top 0.152: JP3.3 32.56,58.84 32.56,57.19 30.53,55.15 30.53,34.64 v30.53,33.61 | U4.9 39.14,14.7 v38.98,14.54
  Bottom 0.152: v38.98,14.54 39.23,14.7 39.66,15.13 39.66,16.25 38.34,17.57 36.56,17.57 36.06,18.08 35.73,18.08 35.37,18.44 34.23,18.44 33.54,19.12 33.54,25.57 31.79,27.33 31.79,32.35 v30.53,33.61
EXINT5
  Top 0.152: U4.10 39.41,15.2 38.78,15.2 38.39,15.59 38.39,16.1 38.72,16.43 39,16.43 39.69,17.12 39.69,18.59 40.68,19.6 40.73,19.66 40.73,24.58 39.59,25.73 39.59,34.65 39.59,34.64 39.58,34.64 55.44,43.8 55.8,45.14 JP4.3
EXINT6  (via drill 0.3)
  Top 0.152: U4.11 41.33,15.7 41.72,16.09 41.72,21.51 v42.42,22.21 | JP5.3 59.56,19.25 58.23,18.89 57.64,17.87 56.56,17.58 54.33,18.87 54.31,18.86 50.16,18.86 50,18.71 48.48,18.71 46.91,20.28 v46.65,20.28
  Bottom 0.152: v42.42,22.21 44.24,22.21 46.17,20.28 v46.65,20.28
EXINT7  (via drill 0.3)
  Top 0.152: JP6.3 39.02,1.95 v39.04,1.94 | v39.65,3.74 39.65,4.88 40.69,5.92 40.69,9.28 39.93,10.04 39.67,10.04 38.5,11.21 38.5,12.17 v37.94,12.73 37.66,13.02 v37.66,14.45 | U4.12 39.41,16.2 v39.03,15.82
  Bottom 0.152: v39.04,1.94 39.04,3.13 v39.65,3.74 | v39.03,15.82 v37.66,14.45
EXINT8  (via drill 0.3)  (1 unrouted)
  Top 0.152: 34.32,18.35 U4.22 34.33,17.69 34.33,16.84 34.02,16.53 33.11,16.53 32.26,17.38 v32.26,17.92
  Top 0.254: JP7.3 14.12,15.42 15.79,16.4 15.79,18.13 v16.29,18.63 15.99,18.33
  Bottom 0.152: 22.62,18.1 22.43,18.3 | 22.43,18.3 22.09,18.63 | 22.53,18.19 22.82,17.9 32.24,17.9 v32.26,17.92 | v16.29,18.63 16.42,18.77 21.96,18.77 22.43,18.3
EXINT9  (via drill 0.3)
  Top 0.152: JP8.3 10.56,41.68 11.98,42.06 12.73,43.35 13.49,43.56 27.74,35.32 27.75,35.23 27.75,32.08 29.22,30.6 v29.22,29.13 | v29.12,25.45 28.87,25.19 28.87,21.41 29.81,20.47 37.47,20.47 38.32,19.62 U4.14 | U4.14
  Bottom 0.152: v29.12,25.45 29.12,25.95 30.26,27.1 30.26,28.09 v29.22,29.13
GND  (via drill 0.3)  (1 unrouted)
  Top 0.152: U4.18 36.32,16.73 36.11,16.47 v35.65,16.3
  Bottom 0.152: v35.65,16.3 35.72,16.3 35.61,16.19 35.52,16.19 35.06,15.74 34.56,15.74 34.38,15.92 34.38,15.97 33.97,16.38 33.97,16.76 33.72,17.01 30.86,17.01 v31.02,17.09
  other vias: 6.05,23.84 23.34,58.22 15.08,9.64 20.22,9.87 13.56,9.55 49.69,58.54 66.52,32.5 55.09,7.74 35.44,10.56 39.58,7.99 31.44,5.42 29.65,22.53 30.72,26.53 37.75,28.36 56.24,50.9 52.35,42.88 44.93,49.73 32.26,46.21 32.33,47.15 32.74,47.96 33.4,48.67 35.38,46.16 33.35,49.64 36.6,49.74 36.63,48.8 36.63,47.85 36.63,46.9 37.87,51.01 37.87,51.96 37.87,52.92 32.16,52.92 32.16,51.96 32.16,51.01 42.98,6.85 39.96,1.94 33.91,1.97 13.68,18.8 15.6,15.31 12.76,16.13 14.08,13.75 16.33,43.25 15.39,41.53 16.61,40.85 17.82,40.15 29.62,52.92 29.62,51.96 29.62,51.01 29.62,49.74 29.62,48.47 29.62,58 33.81,58.02 38.89,58.02 54.74,17.74 55.47,19.11 62.41,20.97 48.19,8.24 14.87,16.83 30.72,29.07 30.74,31.45 28.99,34.55 31.53,37.07 29.07,36.99 41.89,34.55 41.92,37.09 49.41,39.28 24.82,11.53
  pour Top (rank 6): 95.59,46.2 24.1,87.48 -21.62,8.29 49.87,-32.99
  pour Bottom (rank 6): 36.67,-25.37 -21.62,8.29 24.1,87.48 95.59,46.2 49.87,-32.99
MISO  (via drill 0.3)
  Top 0.152: U4.21 34.82,18.56 34.48,18.89 v34.48,19.05
  Bottom 0.152: v34.48,19.05 34.48,19.07 35.12,19.71 36.42,19.71 37.26,18.87 42.34,18.87 U9.A2
MOSI  (via drill 0.3)
  Top 0.152: U4.19 35.82,18.58 36.13,18.89 v36.13,19.07
  Bottom 0.152: v36.13,19.07 36.82,18.39 38.65,18.39 40.14,16.89 U9.A3
N$1
  Top 0.254: LED1.A 23.41,15.46 R1.1
N$2
  Top 0.254: LED2.A 19,15.46 R2.1
N$4
  Bottom 0.305: JP10.1 27.35,18.87 U9.B2
N$5
  Top 0.254: C6.2 44.13,8.72 43.91,8.5 43.91,8.33 43.79,8.2 Y1.P$2 41.55,8.2 41.37,8.38 41.37,10.56 41.23,10.7 U4.1
N$6
  Top 0.254: U4.2 42.15,11.2 Y1.P$1 42.66,10.69 43.74,10.69 43.86,10.56 43.86,10.33 44.08,10.12 C7.2
N$7
  Top 0.254: U4.6 42.54,13.2 L2.1 44.2,13.2 C5.2
N$13
  Bottom 0.305: JP9.1 27.31,20.94 U9.B1
N$14  (via drill 0.3)
  Top 0.152: Q1.1 15.15,12.65 14.56,12.65 14.28,12.37 14.28,8.09 14.54,7.83 U3.5 15.86,7.83 16.09,7.6 16.09,6.46 v16.49,6.05 | R9.2 18.5,8.8 18.17,9.13 v18.17,9.36
  Bottom 0.152: v16.49,6.05 16.49,7.68 v18.17,9.36
N$15  (via drill 0.3)
  Top 0.254: R8.2 46.97,17.98 47.72,17.98 48.02,18.28 v52.92,18.28
  Bottom 0.152: TP6.TP 51.81,17.17 v52.92,18.28
  Bottom 0.254: v52.92,18.28 53.01,18.28
ONOFF  (via drill 0.3)
  Top 0.152: v23.44,9.86 23.44,10.79 U1.3
  Top 0.305: R10.2 22.07,10.92 22.17,10.82 U1.3
  Bottom 0.152: SJ1.1 22.06,11.24 v23.44,9.86
RFM_CS  (via drill 0.3)
  Top 0.152: v38.65,13.36 38.65,13.91 38.34,14.22 38.34,14.68 37.86,15.16 37.02,15.16 v36.74,15.44 | v33.13,15.16 33.13,15.01 32.83,14.7 U4.28 | U4.28
  Bottom 0.152: U9.A5 39.11,12.89 v38.65,13.36 | v33.13,15.16 36.46,15.16 v36.74,15.44
RFM_INT  (via drill 0.3)
  Top 0.152: U4.29 30.15,14.2 29.88,14.47 29.88,15.34 29.27,15.95 v29.27,16.89
  Bottom 0.152: v29.27,16.89 U9.B3
RFM_RST  (via drill 0.3)
  Top 0.152: v36.69,13.23 36.69,14.4 v36.54,14.55 | v33.68,14.56 33.68,14.22 33.17,13.71 31.83,13.71 U4.30
  Bottom 0.152: U9.A6 39.13,10.89 38.72,11.3 37.38,11.3 36.46,12.21 36.46,13 v36.69,13.23 | v36.54,14.55 35.73,14.55 35.52,14.35 33.89,14.35 v33.68,14.56
RXLED  (via drill 0.3)
  Top 0.152: LED1.C 21.85,17.97 v21.84,17.98 | U4.48 38.82,9.21 v39.92,9.21 | v36.01,11.5 34.68,12.82 34.68,14.85 v33.74,15.77
  Bottom 0.152: v21.84,17.98 21.84,16.45 22.32,15.97 33.54,15.97 v33.74,15.77 | v36.01,11.5 36.01,10.89 37,9.9 39.23,9.9 v39.92,9.21
SAMDRESET  (via drill 0.3)
  Top 0.152: v34.82,11.35 U4.40 | JP11.1 v38.91,23.91 v38.9,23.92 38.01,24.81 36.94,24.81 36.46,24.33 v32.88,24.33 | v45.77,17.48 45.77,21.56 v45.59,21.73 | v34.81,16.41 34.81,16.16 35.12,15.86 35.12,13.25 v35.27,13.1
  Top 0.254: R3.1 32.08,6.9 33.07,7.9 34.52,7.9 34.82,8.2 U4.40
  Top 0.305: RESET.1 50.05,17.41 49.98,17.49 49.98,17.42 49.16,16.61 47.35,16.61 46.86,16.61 R8.1 44.93,16.65 v45.77,17.48
  Top 0.406: C10.2 44.79,16.33 44.93,16.65
  Bottom 0.152: v45.59,21.73 45.33,21.73 44.49,22.58 42.91,22.58 42.66,22.83 39.99,22.83 v38.9,23.92 | v34.82,11.35 34.82,12.66 v35.27,13.1 | v34.81,16.41 34.81,17.29 33.16,18.94 33.16,24.05 v32.88,24.33
SCK  (via drill 0.3)
  Top 0.152: U4.20 35.32,19 v35.29,19.05
  Bottom 0.152: v35.29,19.05 35.88,18.46 36.21,18.46 36.69,17.98 38.49,17.98 40.04,16.43 40.04,15.11 40.27,14.88 U9.A4
SCL  (via drill 0.3)  (1 unrouted)
  Top 0.152: U4.32 30.21,12.7 29.88,13.03 29.4,13.03 29.07,13.36 29.07,15.06 28.49,15.64 28.49,15.87 28.23,16.12 26.68,16.12 25.85,16.96 R5.1
  Top 0.254: U4.32 32.94,12.7 33.23,12.4 v33.23,11.45 | v38.68,4.2 35.45,4.2 v35.25,4.4
  Bottom 0.254: JP8.5 11.65,43.98 12.31,43.6 12.56,42.68 | JP3.5 35.08,57.17 35.08,56.71 34.41,56.04 | 59.92,16.11 JP5.5 59.92,16.11 58.08,17.16 57.85,18.03 | 57.02,43.71 57,43.71 56,45.45 56.16,46.05 55.93,46.45 55.34,46.61 49.88,56.04 34.41,56.04 | JP4.5 59.85,44.55 57.95,43.46 57.02,43.71 | 57.85,18.03 59.37,20.65 60.12,20.85 60.54,21.58 60.34,22.34 64.89,30.21 64.79,30.24 57.02,43.71 | 57.85,18.03 57.74,17.83 57.76,17.76 55.66,14.13 50.15,4.59 49.97,4.39 38.87,4.39 v38.68,4.2 | JP6.5 | 12.56,42.68 11.68,41.18 11.16,41.04 10.79,40.4 10.93,39.86 10.41,38.95 10.41,38.93 5.5,30.43 10.3,22.1 12.4,18.47 12.16,17.59 | 12.56,42.68 13.24,43.85 13.23,43.87 15.14,47.17 20.23,56 20.26,56.01 20.29,56.04 29.13,56.04 29.69,56.6 30.4,56.6 30.96,56.04 34.41,56.04 | 12.26,17.95 12.16,17.59 | 12.16,17.59 12.04,17.12 10.52,16.24 JP7.5 | JP6.5 | 33.26,6.85 33.57,6.54 35.25,4.86 v35.25,4.4 JP6.5 | v33.23,11.45 33.23,6.88 33.28,6.83
SDA  (via drill 0.3)
  Top 0.152: 30.89,13.2 U4.31 | R4.1 27.97,16.95 28.87,16.05 28.87,15.79 29.48,15.18 29.48,13.56 29.63,13.41 30.04,13.41 30.24,13.2 U4.31 | U4.31
  Top 0.254: U4.31 33.18,13.2 33.92,12.46 v33.92,12.21 | v33.98,4.35 34.18,4.35 34.92,5.09 v36.42,5.09 | v13.12,19.82 11.66,18.98 v11.5,18.36 | v13.34,45.94 15.22,44.85 v15.24,44.86 | v37.61,56.98 37.61,54.77 v37.64,54.75 | v59.46,41.45 v57.57,40.36 | v57.04,14.86 55.35,15.84 v55.29,15.82
  Bottom 0.254: 63.72,30.11 57.81,40.29 v57.57,40.36 57.64,40.61 49.31,55.09 37.96,55.07 v37.64,54.75 37.61,54.75 37.28,55.08 20.86,55.09 20.82,55.06 16.64,47.81 | 63.72,30.11 63.72,30.1 | 63.72,30.11 61.39,26.06 55.51,15.88 v55.29,15.82 55.34,15.61 50.83,7.79 49.35,5.35 39.98,5.35 37.9,5.35 37.64,5.09 v36.42,5.09 | 16.64,47.81 16.63,47.81 | 16.64,47.81 15.14,45.22 v15.24,44.86 15.21,44.87 14.9,44.79 6.6,30.42 6.61,30.43 12.66,19.94 v13.12,19.82 | JP6.4 32.71,3.68 33.37,4.35 v33.98,4.35 | v11.5,18.36 10.22,17.62 9.6,17.79 JP7.4 | JP8.4 v13.34,45.94 | JP3.4 v37.62,56.99 v37.61,56.98 | JP4.4 60.2,41.81 60.12,41.83 v59.46,41.45 | JP5.4 57.05,14.84 v57.04,14.86
  Bottom 0.305: v33.92,12.21 33.92,12.16 33.92,7.32 33.92,6.9 35.74,5.09 v36.42,5.09
SWCLK  (via drill 0.3)
  Top 0.152: v37.89,11.91 37.82,11.91 37.26,11.35 37.26,10.46 37.31,10.41 U4.45 | v46.91,11.48 49.62,11.48 v50.28,12.14
  Bottom 0.152: v37.89,11.91 40.17,11.91 40.22,11.86 46.53,11.86 v46.91,11.48 | v50.28,12.14 50.28,13.32 TP5.TP
  Bottom 0.254: 46.84,11.4 v46.91,11.48
SWDIO  (via drill 0.3)
  Top 0.254: U4.46 37.84,9.23 37.84,10.63 v37.87,10.66 | R7.1 46.72,9.97 v47.57,10.82 50.32,10.82 v50.69,11.19
  Bottom 0.152: v37.87,10.66 38.57,10.66 38.93,10.3 40.04,10.3 40.51,9.83 46.58,9.83 v47.57,10.82
  Bottom 0.254: v50.69,11.19 TP4.TP
TACTILE_BUTTON  (via drill 0.3)
  Top 0.152: C15.2 37.2,21.31 R13.1 37.68,21.17 37.96,21.45 37.96,21.73 38.22,21.99 38.9,21.99 38.9,20.98 38.91,21.13 | 38.92,21.99 39.79,21.99 39.97,22.16 39.97,24.3 39.62,24.65 39.08,24.65 38.68,25.06 37.56,26.18 37.56,26.26 | v38.29,27.61 38.29,27 S1.1 35.79,28.06 34.89,28.06 34.66,28.29 31.71,28.29 31.05,27.63 U$1.C3 | 38.92,21.99 | 38.92,21.99 JP11.2
  Top 0.254: 37.56,26.26 S1.1
  Bottom 0.152: U$1.C4 38.32,27.63 v38.29,27.61
TACTILE_LED  (via drill 0.3)
  Top 0.152: S1.3 32.5,27.48 v32.47,27.5
  Top 0.254: 32.43,26.21 S1.3 32.5,24.87 31.98,24.35 31.23,24.35 30.88,24.01 R14.2
  Bottom 0.152: v32.47,27.5 32.47,27.53 32.91,27.96 32.91,36.34 33.69,37.13 U$1.L1 | U$1.L1
TARGET_USB_N  (via drill 0.3)
  Top 0.152: USB1.2 24.32,8.23 D2.3 23.64,9 v24.48,9.85 | U4.33 29.8,12.21 v29.63,12.39
  Bottom 0.152: v24.48,9.85 27.02,12.39 v29.63,12.39
TARGET_USB_P  (via drill 0.3)
  Top 0.152: USB1.3 24.97,8.24 D2.2 25.64,9.84 v25.63,9.85 | U4.34 29.8,11.71 v29.63,11.53
  Bottom 0.152: v29.63,11.53 27.25,11.53 25.63,9.9 v25.63,9.85
TXLED  (via drill 0.3)
  Top 0.152: LED2.C 20.58,17.99 v20.6,18 | U4.39 34.33,9.21 34.33,10.23 34.05,10.51 33.16,10.51 32.26,9.61 v32.26,9.19
  Bottom 0.152: v20.6,18 20.6,15.82 20.6,11.8 24.48,7.92 30.99,7.92 v32.26,9.19
VBAT  (via drill 0.3)
  Top 0.152: U3.3 17.29,9.34 v17.31,9.36 | v17.59,12.77 v17.56,12.77 | 17.26,11.69 Q1.3 | v56.78,46.35 55.75,45.76 v55.43,45.84
  Top 0.254: C2.2 16.95,18.12 v16.96,18.08 | v10.33,41.07 11.49,40.4 v11.5,40.37 | v31.62,57.13 31.26,57.13 v30.04,55.92 | v60.03,19.88 v59.61,21.44 | v15.62,13.85 16.51,13.85 v17.59,12.77
  Top 0.305: v17.56,12.77 17.26,12.47 17.26,11.69
  Bottom 0.152: JP4.6 57.51,46.12 v56.78,46.35 | 56.22,16.14 56.22,16.13 56.22,16.12
  Bottom 0.254: 56.22,16.14 59.22,21.33 v59.61,21.44 59.51,21.82 64.27,30.1 64.28,30.12 57.72,41.49 55.36,45.57 v55.43,45.84 55.16,45.91 49.59,55.58 30.35,55.61 v30.04,55.92 | 56.22,16.12 49.66,4.88 38.63,4.88 38.42,4.88 37.79,4.25 JP6.6 | 20.55,55.55 20.5,55.47 | 20.5,55.47 11.83,40.46 v11.5,40.37 11.6,40.02 6.25,30.75 6.04,30.44 11.18,21.55 | 11.51,20.98 11.18,21.55 | 11.18,21.55 13.49,17.55 13.76,17.08 | JP7.6 13.16,14.87 13.76,17.08 | 13.76,17.08 v15.62,13.85 v15.63,13.85 | JP8.6 10.09,41.95 v10.33,41.07 | v30.04,55.92 29.71,55.58 29.64,55.58 | 29.64,55.58 20.61,55.58 20.5,55.47 | JP3.6 32.54,58.06 v31.62,57.13 | v30.04,55.92 29.98,55.92 29.64,55.58 | JP5.6 60.31,18.82 v60.03,19.88
  Bottom 0.305: v17.31,9.36 17.31,9.7 17.76,10.16 17.76,12.59 v17.59,12.77 | v17.56,12.77 17.56,17.48 v16.96,18.08
VDDCORE
  Top 0.254: U4.43 36.32,8.15 35.74,7.57 35.74,6.83 C3.2
VIN  (via drill 0.3)
  Top 0.152: 15.18,10.71 Q1.2 | C12.2 v19.31,9.85 | v23.42,13.76 U1.1 | v19.72,13.76 v23.42,13.76 | v23.42,13.76
  Top 0.305: 15.18,10.71 15.96,10.71 16.16,10.51 v17.13,10.51 18.22,10.51 18.63,10.92 C12.2 | U3.6 15.02,6.54 v15.5,6.05
  Bottom 0.152: v23.42,13.76 SJ1.2 | v19.31,9.85 19.31,13.35 v19.72,13.76
  Bottom 0.305: v17.13,10.51 15.5,8.89 v15.5,6.05
VINUSB
  Top 0.406: USB1.1 23.67,6.98 D2.4 23.03,7.01 22.63,7.41 22.63,8.52 22.3,8.85 21.02,8.85 F2.1
VUSB
  Top 0.406: U3.1 19.24,7.18 R9.1 | R9.1 20.93,7.11 F2.2 | C1.2 R9.1

### Text on the board
tNames: Internet of Things / with a soft touch. | An educational project by | Developed by
bNames: TX | RX | G. Leenders / 3/6/21